# EAGLE design 0244_imu_BMI088 (EAGLE 9.6.2)
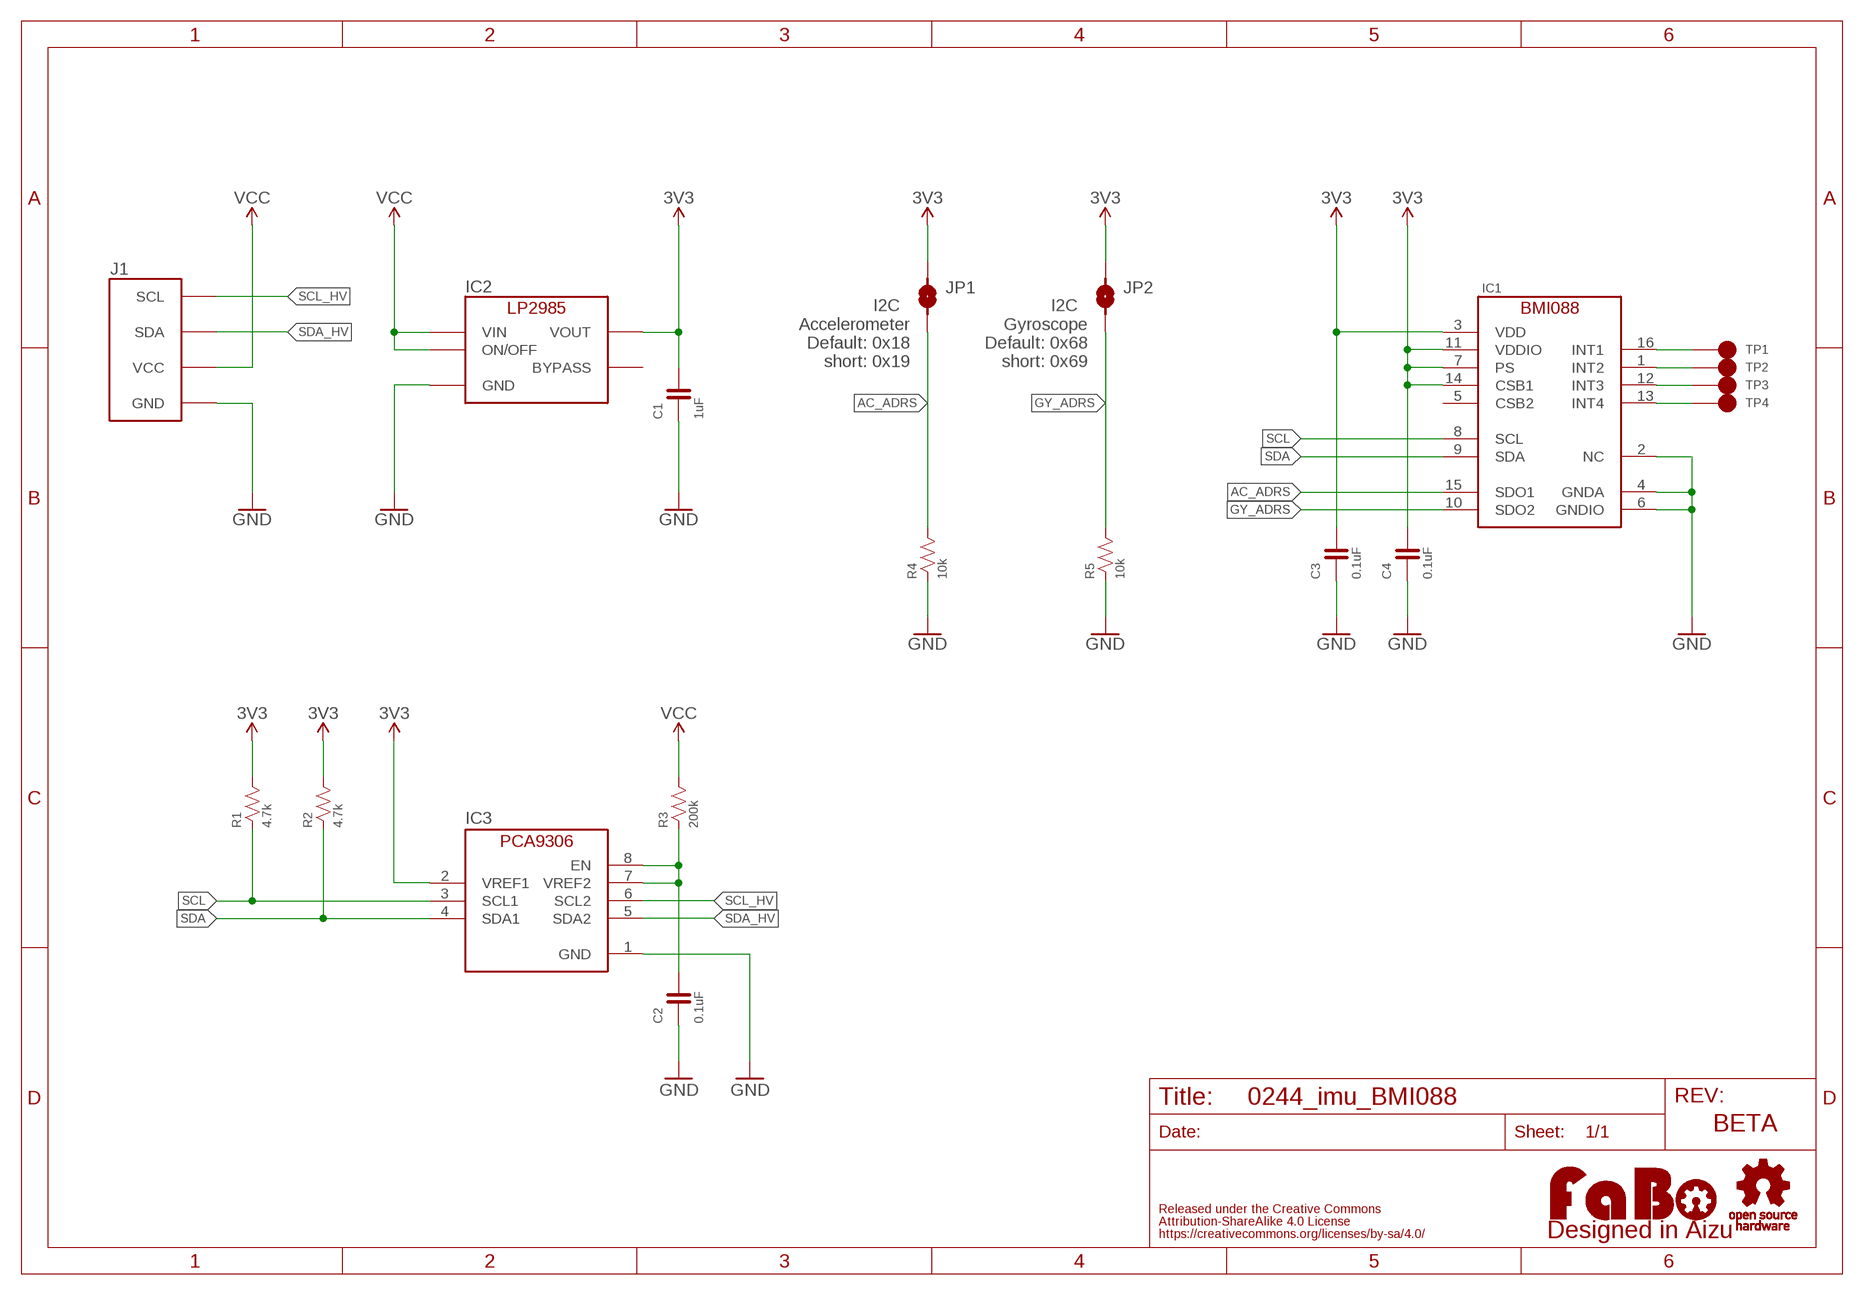
[diagram p0: schematic, sheet 1]

## Parts
C1  1uF  CAPACITOR-0603  [EIA0603]
C2  0.1uF  CAPACITOR-0603  [EIA0603]
C3  0.1uF  CAPACITOR-0603  [EIA0603]
C4  0.1uF  CAPACITOR-0603  [EIA0603]
IC1  BMI088  [BMI088]
IC2  LP2985-33DBV  [SOT-23-5]
IC3  PCA9306GM  [XQFN8]
J1  FABO_BRICK_I2C  [FABO_BRICK_I2C]
JP1  JUMPER-2_SMD  [JUMPER-SMD-2]
JP2  JUMPER-2_SMD  [JUMPER-SMD-2]
LOGO1  LOGO_FABO-M  [LOGO_FABO_M]
R1  4.7k  RESISTOR-0603  [EIA0603]
R2  4.7k  RESISTOR-0603  [EIA0603]
R3  200k  RESISTOR-0603  [EIA0603]
R4  10k  RESISTOR-0603  [EIA0603]
R5  10k  RESISTOR-0603  [EIA0603]
TP1  TP-15  [TP-15]
TP2  TP-15  [TP-15]
TP3  TP-15  [TP-15]
TP4  TP-15  [TP-15]
U$2  LOGO_OSHW-M_BOTTOM  [LOGO_OSHW_M_BOTTOM]

## Nets
3V3: C1.2 C3.2 C4.2 IC1.3(VDD) IC1.7(PS) IC1.11(VDDIO) IC1.14(CSB1) IC2.5(VOUT) IC3.2(VREF1) JP1.1 JP2.1 R1.2 R2.2
AC_ADRS: IC1.15(SDO1) JP1.2 R4.2
GND: C1.1 C2.1 C3.1 C4.1 IC1.2(NC) IC1.4(GNDA) IC1.6(GNDIO) IC2.2(GND) IC3.1(GND) J1.GND R4.1 R5.1
GY_ADRS: IC1.10(SDO2) JP2.2 R5.2
INT1: IC1.16(INT1) TP1.1
INT2: IC1.1(INT2) TP2.1
INT3: IC1.12(INT3) TP3.1
INT4: IC1.13(INT4) TP4.1
PCAVREF: C2.2 IC3.7(VREF2) IC3.8(EN) R3.1
SCL: IC1.8(SCL) IC3.3(SCL1) R1.1
SCL_HV: IC3.6(SCL2) J1.SCL
SDA: IC1.9(SDA) IC3.4(SDA1) R2.1
SDA_HV: IC3.5(SDA2) J1.SDA
VCC: IC2.1(VIN) IC2.3(ON/OFF) J1.VCC R3.2
Unconnected: IC1.5(CSB2) IC2.4(BYPASS)

## Notes on the sheet
- I2C  
  Accelerometer
  Default: 0x18
  short: 0x19
- I2C  
  Gyroscope
  Default: 0x68
  short: 0x69
- BETA

## Library data of the parts
C1-C4 = component:CAPACITOR
IC1 = component:BMI088
IC2 = FaBo-Supply:LP2985: LP2985
IC3 = FaBo-LevelTranslator:PCA9306
J1 = FaBo-Template:FABO_BRICK_I2C: FaBo Brick I2C
JP1 JP2 = component:JUMPER-2
LOGO1 = component:LOGO_FABO
R1-R5 = component:RESISTOR
TP1-TP4 = component:TP
U$2 = FaBo-etc:LOGO_OSHW

## Board
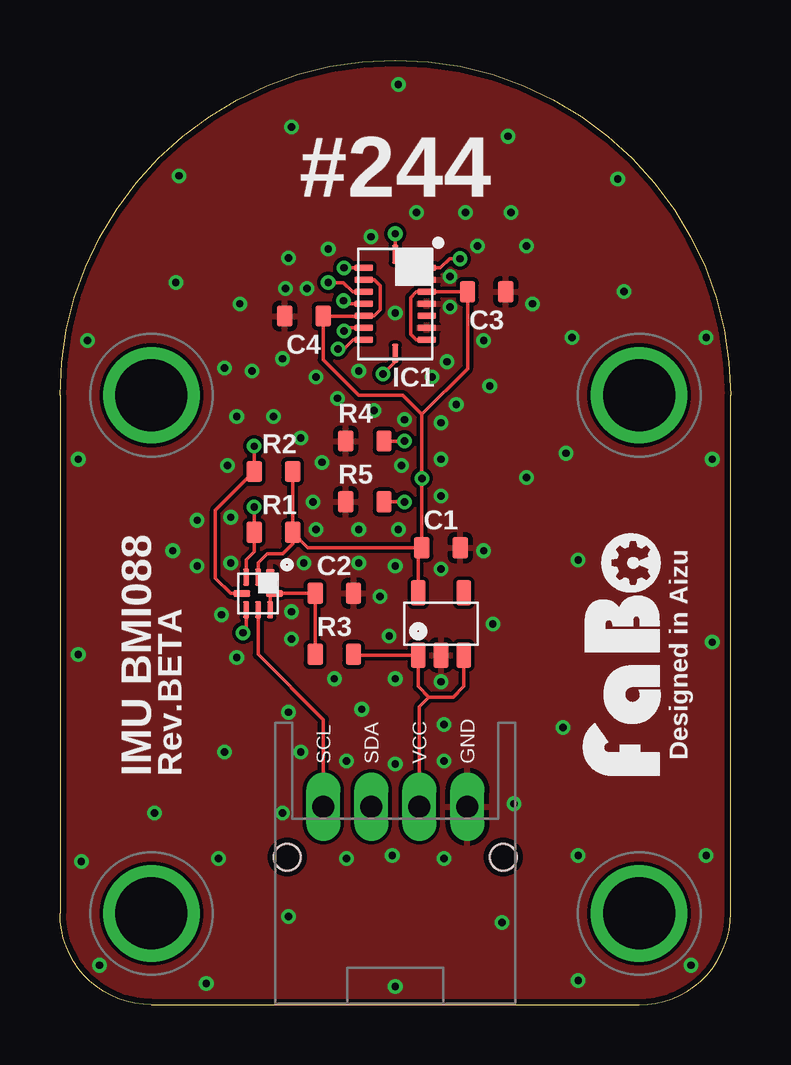
[diagram p1: board, top side]
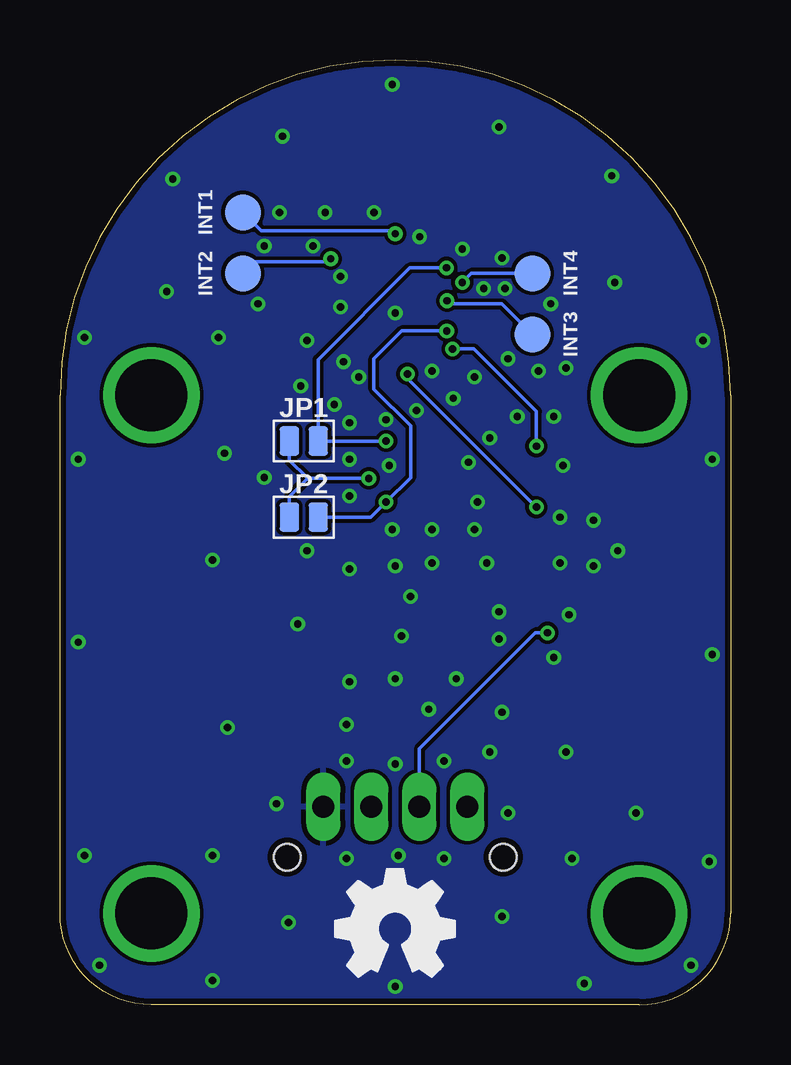
[diagram p2: board, bottom side, seen from below]

Size 27.94 x 39.37 mm. Coordinates in mm from the lower left corner, seen from the top.
Copper layers (1*16): Top 0.035mm / dielectric 1.6mm / Bottom 0.035mm
Design rules "PCBway": minimum track width 6mil, minimum drill 12mil, track to track 6mil, track to pad 6mil, pad to pad 6mil, via to via 6mil, smd to smd 6mil, copper to edge 10mil, drill to drill 10mil, minimum pad ring 10mil, minimum via ring 6mil, stop-mask expansion 2mil, vias tented up to drill 100mil, thermal gap 8mil

### Footprints (pad centres in the part's own frame; a part is rotated, then mirrored left to right if it is on the bottom)
EIA0603 = smd 0.65 x 0.9: 1 -0.8,0; 2 0.8,0
BMI088 = smd 0.25 x 0.775: 1 -1.5,1.312; 2 -1,1.312; 3 -0.5,1.312; 4 0,1.312; 5 0.5,1.312; 6 1,1.312; 7 1.5,1.312; 9 1.5,-1.312; 10 1,-1.312; 11 0.5,-1.312; 12 0,-1.312; 13 -0.5,-1.312; 14 -1,-1.312; 15 -1.5,-1.312 | smd 0.775 x 0.25: 8 2.062,0; 16 -2.062,0
SOT-23-5 = smd 0.6 x 1.05: 1 -0.95,-1.3; 2 0,-1.3; 3 0.95,-1.3; 4 0.95,1.3; 5 -0.95,1.3
XQFN8 = smd 0.7 x 0.35: 1 -0.675,0.5 | smd 0.7 x 0.25: 2 -0.675,0; 3 -0.675,-0.5; 5 0.675,-0.5; 6 0.675,0; 7 0.675,0.5 | smd 0.25 x 0.7: 4 0,-0.675; 8 0,0.675
FABO_BRICK_I2C = drill 0.9 pad 1.422 long: GND 3,-10.795; SCL -3,-10.795; SDA -1,-10.795; VCC 1,-10.795 | drill 3 pad 3.81: P$1 -10.16,6.35; P$2 10.16,6.35; P$3 -10.16,-15.24; P$4 10.16,-15.24 | hole 1.1: -4.5,-12.895; 4.5,-12.895
JUMPER-SMD-2 = smd 0.8 x 1.2: 1 -0.6,0; 2 0.6,0
TP-15 = smd 1.5 x 1.5: 1 0,0

### Placement (x,y rotation side)
C1  15.88,19.05 180 top
C2  11.43,17.14 180 top
C3  17.78,29.72 180 top
C4  10.16,28.7 0 top
IC1  13.97,29.21 270 top
IC2  15.88,15.88 0 top
IC3  8.26,17.14 270 top
J1  13.97,19.05 0 top
JP1  17.78,23.5 0 bottom
JP2  17.78,20.32 0 bottom
LOGO1  25.4,14.61 90 top
R1  8.89,19.68 0 top
R2  8.89,22.23 0 top
R3  11.43,14.61 0 top
R4  12.7,23.5 0 top
R5  12.7,20.95 0 top
TP1  20.32,33.02 0 bottom
TP2  20.32,30.48 0 bottom
TP3  8.26,27.94 0 bottom
TP4  8.26,30.48 0 bottom
U$2  13.97,3.17 0 top

### Tracks (layer width: path | path; a pad name or v marks a point on that pad's centre or on a via)
3V3  (via drill 0.3)
  Top 0.152: IC2.5 14.93,18.9 C1.2 | 15.07,24.6 15.07,21.97 | 15.07,21.97 C1.2 | 15.07,24.6 16.98,26.5 C3.2 IC1.3 14.85,29.71 14.61,29.46 14.61,27.94 14.84,27.71 IC1.7 | 15.07,24.6 14.28,25.4 12.45,25.4 10.96,26.89 C4.2 12.65,28.7 IC1.11 13.09,28.71 13.34,28.96 13.34,29.97 13.1,30.21 IC1.14 | IC3.2 8.26,18.41 8.64,18.8 9.27,18.8 9.69,19.21 R1.2 | R1.2 10.32,19.05 C1.2 | R1.2 R2.2 | v15.08,21.94 15.08,21.97 15.07,21.97
  Bottom 0.152: JP1.1 18.38,22.7 17.62,21.94 | v15.08,21.94 17.62,21.94 | JP2.1 18.38,21.17 17.62,21.94
AC_ADRS  (via drill 0.3)
  Top 0.152: IC1.15 v11.84,30.71 | R4.2 v14.35,23.5
  Bottom 0.152: v11.84,30.71 13.36,30.71 17.18,26.89 JP1.2 v14.35,23.5
GND  (via drill 0.3)
  other vias: 16.26,29.08 16.26,30.35 10.29,29.84 12.45,26.42 16.13,26.8 15.49,26.16 16.51,25.02 15.88,24.26 15.88,22.73 15.88,21.21 14.22,22.48 14.35,24.38 15.88,13.46 13.08,24.77 11.56,25.27 10.67,26.16 9.27,26.92 8.89,24.51 7.37,24.51 10.92,22.61 10.03,23.62 6.86,26.54 13.97,28.83 17.65,27.69 17.4,31.62 19.43,31.62 12.95,32 11.18,31.5 9.53,31.11 9.4,29.84 7.49,29.21 8,26.42 19.68,29.21 14.86,33.02 18.8,33.02 16.89,33.02 17.91,25.78 10.54,20.95 6.99,22.48 14.1,19.81 10.67,19.81 10.16,18.41 13.97,18.29 15.88,18.16 17.65,18.92 18.03,15.88 13.72,15.37 13.34,17.02 12.45,19.81 12.45,18.41 9.65,16.38 9.65,15.24 7.37,14.48 6.73,16.26 7.11,18.41 7.11,20.32 5.71,20.19 5.71,18.29 26.92,27.81 27.18,22.73 21.08,22.99 21.34,27.81 1.14,27.69 0.76,22.73 19.43,21.97 14.1,38.35 4.95,34.54 23.24,34.42 18.67,36.2 9.65,36.58 4.83,30.1 23.5,29.72 26.29,1.65 26.92,6.22 21.59,6.22 21.59,1.02 1.65,1.65 0.89,5.97 6.1,0.89 6.6,6.1 13.97,0.76 18.41,3.43 9.53,3.68 11.94,6.1 13.84,6.22 16,6.1 18.92,8.38 9.27,8 10.03,10.54 11.94,10.16 13.97,10.03 16,10.16 16,11.68 13.97,13.59 11.43,13.59 9.53,12.19 6.86,10.54 27.18,15.11 0.76,14.61 4.7,18.92 3.94,8 21.59,18.54 20.95,11.56 12.57,12.32
  pour Top (isolate 0.152, rank 3): 0,0 0,39.37 27.94,39.37 27.94,0
  pour Bottom (isolate 0.152, rank 3): 0,0 0,39.37 27.94,39.37 27.94,0
GY_ADRS  (via drill 0.3)
  Top 0.152: IC1.10 11.95,28.21 v11.83,28.08 | R5.2 v14.35,20.95
  Bottom 0.152: v11.83,28.08 13.7,28.08 14.86,26.92 14.86,25.65 13.34,24.13 13.34,21.97 v14.35,20.95 14.99,20.32 JP2.2
INT1  (via drill 0.3)
  Top 0.152: IC1.16 v13.97,32.13
  Bottom 0.152: v13.97,32.13 14.1,32.26 19.56,32.26 TP1.1
INT2  (via drill 0.3)
  Top 0.152: IC1.1 15.85,30.71 16.23,31.09 v16.66,31.09
  Bottom 0.152: TP2.1 19.84,30.96 16.79,30.96 v16.66,31.09
INT3  (via drill 0.3)
  Top 0.152: IC1.12 11.94,29.21 v11.81,29.34
  Bottom 0.152: v11.81,29.34 11.68,29.21 9.53,29.21 TP3.1
INT4  (via drill 0.3)
  Top 0.152: IC1.13 12.2,29.71 11.81,30.1 v11.18,30.1
  Bottom 0.152: TP4.1 10.79,30.48 v11.18,30.1
PCAVREF
  Top 0.152: R3.1 C2.2 IC3.8 8.76,17.14 IC3.7
SCL  (via drill 0.3)
  Top 0.152: IC3.3 7.75,18.55 8.09,18.89 R1.1 v8.09,20.74 | IC1.8 13.97,26.8 v13.46,26.29
  Bottom 0.152: v13.46,26.29 13.46,26.11 v8.09,20.74
SCL_HV
  Top 0.152: IC3.6 8.26,14.61 10.97,11.89 J1.SCL
SDA  (via drill 0.3)
  Top 0.152: IC3.4 7.11,17.14 6.48,17.78 6.48,20.61 R2.1 v8.09,23.28 | IC1.9 12.22,27.71 11.84,27.33 v11.58,27.33
  Bottom 0.152: v11.58,27.33 10.69,27.33 8.09,24.73 v8.09,23.28
SDA_HV  (via drill 0.3)
  Top 0.152: IC3.5 7.75,15.63 v7.63,15.5
  Bottom 0.152: v7.63,15.5 8.14,15.5 12.97,10.67 J1.SDA
VCC
  Top 0.152: 15.37,12.83 14.93,13.27 IC2.1 12.26,14.57 R3.2 | IC2.3 16.82,13.27 16.38,12.83 15.37,12.83 | J1.VCC 14.97,12.43 15.37,12.83

### Text on the board
tPlace: #244 | Designed in Aizu | IMU BMI088 | Rev.BETA
bPlace: INT1 | INT4 | INT2 | INT3